# EAGLE schematic Schematic (EAGLE 8.7.1)
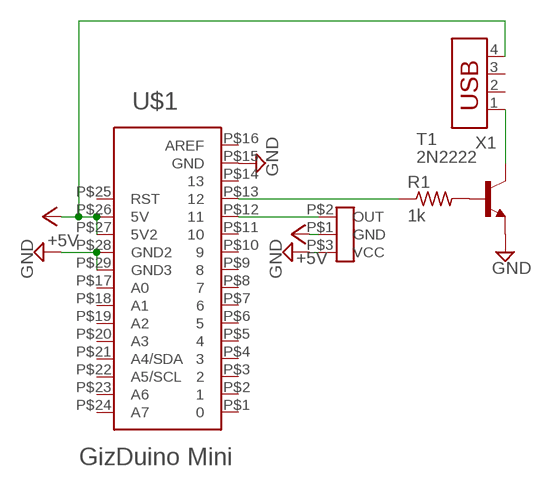
[diagram p0: schematic, sheet 1]

## Parts
R1  1k  R-US_0204/7  [0204/7]
T1  2N2222  [TO18]
U1  SOUND_SENSOR_MODULE  [SOUND_SENSOR_MODULE]
U$1  GIZDUINO-MINI  [GIZDUINO-MINI]
X1  USB-787616  [USB]

## Nets
+5V: U1.P$1(GND) U$1.P$26(5V) U$1.P$27(5V2) X1.4
GND: T1.1(E) U1.P$3(VCC) U$1.P$15(GND) U$1.P$28(GND2) U$1.P$29(GND3)
N$1: U1.P$2(OUT) U$1.P$12
N$2: R1.2 T1.2(B)
N$3: R1.1 U$1.P$13
N$4: T1.3(C) X1.1
Unconnected: U$1.P$1 U$1.P$2 U$1.P$3 U$1.P$4 U$1.P$5 U$1.P$6 U$1.P$7 U$1.P$8 U$1.P$9 U$1.P$10 U$1.P$11 U$1.P$14 U$1.P$16(AREF) U$1.P$17(A0) U$1.P$18(A1) U$1.P$19(A2) U$1.P$20(A3) U$1.P$21(A4/SDA) U$1.P$22(A5/SCL) U$1.P$23(A6) U$1.P$24(A7) U$1.P$25(RST) X1.2 X1.3

## Library data of the parts
R1 = resistor:R-US_: RESISTOR, American symbol
T1 = transistor:2N2222: NPN TRANSISTOR
U1 = my sensors:SOUND_SENSOR_MODULE
U$1 = personal arduino:GIZDUINO-MINI: Mini Variant of Gizduino Line of Microcontrollers
X1 = con-amp:USB-787616: AMP connector